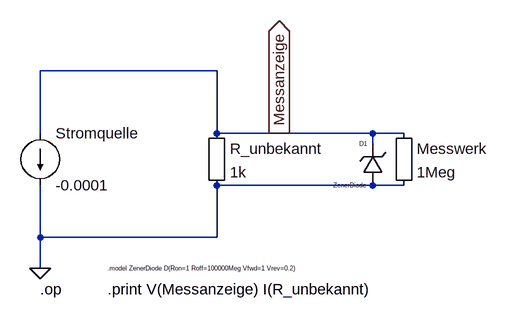
[diagram p0: schematic V1 Widerstandsmesser.asc]
V1 Widerstandsmesser.asc, the LTspice schematic file:
Version 4
SHEET 1 920 680
WIRE 112 64 -160 64
WIRE -160 160 -160 64
WIRE 112 160 112 64
WIRE 208 160 112 160
WIRE 352 160 208 160
WIRE 400 160 352 160
WIRE 352 176 352 160
WIRE 352 240 112 240
WIRE 400 240 352 240
WIRE -160 320 -160 240
WIRE 112 320 112 240
WIRE 112 320 -160 320
WIRE -160 368 -160 320
FLAG -160 368 0
FLAG 208 160 Messanzeige
IOPIN 208 160 Out
SYMBOL Misc\\EuropeanResistor 96 144 R0
SYMATTR InstName R_unbekannt
SYMATTR Value 1k
SYMBOL Misc\\EuropeanResistor 384 144 R0
SYMATTR InstName Messwerk
SYMATTR Value 1Meg
SYMBOL current -160 160 R0
WINDOW 123 0 0 Left 0
WINDOW 39 0 0 Left 0
SYMATTR InstName Stromquelle
SYMATTR Value -0.0001
SYMBOL zener 368 240 R180
WINDOW 0 24 64 Left 0
WINDOW 3 24 0 Left 0
SYMATTR InstName D1
SYMATTR Value ZenerDiode
TEXT -160 400 Left 2 !.op
TEXT -56 400 Left 2 !.print V(Messanzeige) I(R_unbekannt)
TEXT -56 368 Left 0 !.model ZenerDiode D(Ron=1 Roff=100000Meg Vfwd=1 Vrev=0.2)

The netlist it stands for:
* V1 Widerstandsmesser.asc
R_unbekannt Messanzeige 0 1k
R§Messwerk Messanzeige 0 1Meg
I§Stromquelle Messanzeige 0 -0.0001
D1 0 Messanzeige ZenerDiode
.model D D
.lib standard.dio
.op
.print V(Messanzeige) I(R_unbekannt)
.model ZenerDiode D(Ron=1 Roff=100000Meg Vfwd=1 Vrev=0.2)
.backanno
.end